# EAGLE design r10.2_328_1284 (EAGLE 9.0.1)
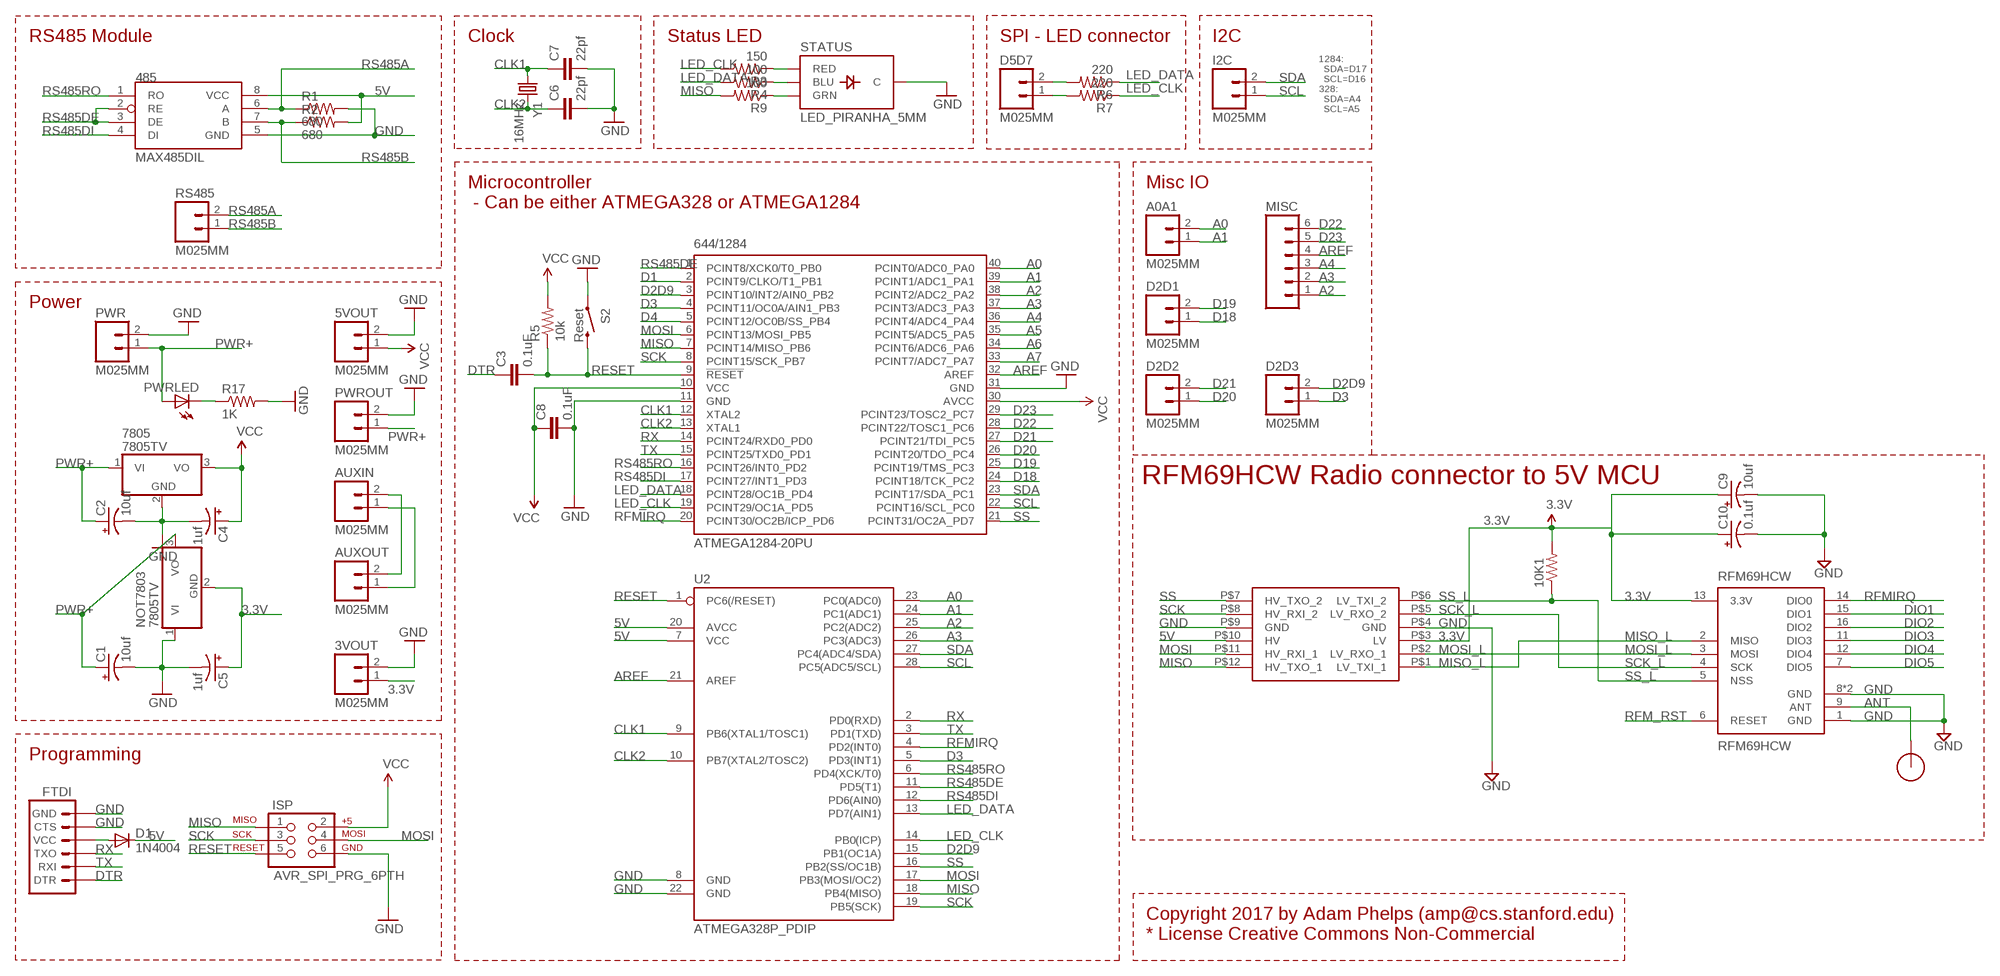
[diagram p0: schematic, sheet 1]

## Parts
3VOUT  M025MM  [SCREWTERMINAL-5MM-2]
5VOUT  M025MM  [SCREWTERMINAL-5MM-2]
10K1  RESISTORPTH-1/4W  [AXIAL-0.4]
485  MAX485DIL  [DIL08]
644/1284  ATMEGA1284-20PU  ATMEGA644-20PU  [DIL40]
7805  7805TV  [TO220V]
A0A1  M025MM  [SCREWTERMINAL-5MM-2]
AUXIN  M025MM  [SCREWTERMINAL-5MM-2]
AUXOUT  M025MM  [SCREWTERMINAL-5MM-2]
C1  10uf  CAP_POLPTH2  [CPOL-RADIAL-10UF-25V]
C2  10uf  CAP_POLPTH2  [CPOL-RADIAL-10UF-25V]
C3  0.1uF  CAPPTH  [CAP-PTH-SMALL]
C4  1uf  CAP_POLPTH2  [CPOL-RADIAL-10UF-25V]
C5  1uf  CAP_POLPTH2  [CPOL-RADIAL-10UF-25V]
C6  22pf  CAPPTH  [CAP-PTH-SMALL]
C7  22pf  CAPPTH  [CAP-PTH-SMALL]
C8  0.1uF  CAPPTH  [CAP-PTH-SMALL]
C9  10uf  CAP_POLPTH2  [CPOL-RADIAL-10UF-25V]
C10  0.1uf  CAP_POLPTH2  [CPOL-RADIAL-10UF-25V]
D1  1N4004  [DO41-10]
D2D1  M025MM  [SCREWTERMINAL-5MM-2]
D2D2  M025MM  [SCREWTERMINAL-5MM-2]
D2D3  M025MM  [SCREWTERMINAL-5MM-2]
D5D7  M025MM  [SCREWTERMINAL-5MM-2]
FTDI  ARDUINO_SERIAL_PROGRAMPTH  [1X06]
I2C  M025MM  [SCREWTERMINAL-5MM-2]
ISP  AVR_SPI_PRG_6PTH  [2X3]
LEVELCONVERTER1  LOGIC_LEVEL_CONVERTER  [LOGIC_LEVEL_CONVERTER]
MISC  M06NO_SILK  [1X06_NO_SILK]
NOT7803  7805TV  [TO220V]
PWR  M025MM  [SCREWTERMINAL-5MM-2]
PWRLED  LED5MM  [LED5MM]
PWROUT  M025MM  [SCREWTERMINAL-5MM-2]
R1  680  RESISTORPTH-1/4W  [AXIAL-0.4]
R2  680  RESISTORPTH-1/4W  [AXIAL-0.4]
R3  150  RESISTORPTH-1/4W  [AXIAL-0.4]
R4  100  RESISTORPTH-1/4W  [AXIAL-0.4]
R5  10k  RESISTORPTH-1/4W  [AXIAL-0.4]
R6  220  RESISTORPTH-1/4W  [AXIAL-0.4]
R7  220  RESISTORPTH-1/4W  [AXIAL-0.4]
R9  100  RESISTORPTH-1/4W  [AXIAL-0.4]
R17  1K  RESISTORPTH-1/4W  [AXIAL-0.4]
RFM69HCW  RFM69HCW  [RFM69HCW-XXXS2]
RS485  M025MM  [SCREWTERMINAL-5MM-2]
S2  Reset  SWITCH-MOMENTARY-2SMD  [TACTILE_SWITCH_SMD]
STATUS  LED_PIRANHA_5MM  [LED_PIRANHA_5MM]
U2  ATMEGA328P_PDIP  [DIL28-3]
U$2  RFM12B_ANTENNA  [RFM12B-ANTENNA]
Y1  16MHz  CRYSTALHC49US  [HC49US]

## Nets
3.3V: 3VOUT.1 10K1.P$2 C5.1(+) C9.1(+) C10.1(+) LEVELCONVERTER1.P$3(LV) NOT7803.2(GND) RFM69HCW.13(3.3V)
5V: 5VOUT.1 485.8(VCC) 644/1284.10(VCC) 644/1284.30(AVCC) 7805.3(VO) C4.1(+) C8.1 D1.C ISP.2 LEVELCONVERTER1.P$10(HV) R2.P$2 R5.P$2 U2.7(VCC) U2.20(AVCC) ; supply symbol labelled VCC
A0: 644/1284.40(PCINT0/ADC0_PA0) A0A1.2 U2.23(PC0(ADC0))
A1: 644/1284.39(PCINT1/ADC1_PA1) A0A1.1 U2.24(PC1(ADC1))
A2: 644/1284.38(PCINT2/ADC2_PA2) MISC.1 U2.25(PC2(ADC2))
A3: 644/1284.37(PCINT3/ADC3_PA3) MISC.2 U2.26(PC3(ADC3))
A4: 644/1284.36(PCINT4/ADC4_PA4) MISC.3
A5: 644/1284.35(PCINT5/ADC5_PA5)
A6: 644/1284.34(PCINT6/ADC6_PA6)
A7: 644/1284.33(PCINT7/ADC7_PA7)
ANT: RFM69HCW.9(ANT) U$2.P$1
AREF: 644/1284.32(AREF) MISC.4 U2.21(AREF)
CLK1: 644/1284.12(XTAL2) C7.1 U2.9(PB6(XTAL1/TOSC1)) Y1.1
CLK2: 644/1284.13(XTAL1) C6.1 U2.10(PB7(XTAL2/TOSC2)) Y1.2
D1: 644/1284.2(PCINT9/CLKO/T1_PB1)
D2D9: 644/1284.3(PCINT10/INT2/AIN0_PB2) D2D3.2 U2.15(PB1(OC1A))
D3: 644/1284.4(PCINT11/OC0A/AIN1_PB3) D2D3.1 U2.5(PD3(INT1))
D4: 644/1284.5(PCINT12/OC0B/SS_PB4)
D18: 644/1284.24(PCINT18/TCK_PC2) D2D1.1
D19: 644/1284.25(PCINT19/TMS_PC3) D2D1.2
D20: 644/1284.26(PCINT20/TDO_PC4) D2D2.1
D21: 644/1284.27(PCINT21/TDI_PC5) D2D2.2
D22: 644/1284.28(PCINT22/TOSC1_PC6) MISC.6
D23: 644/1284.29(PCINT23/TOSC2_PC7) MISC.5
DIO1: RFM69HCW.15(DIO1)
DIO2: RFM69HCW.16(DIO2)
DIO3: RFM69HCW.11(DIO3)
DIO4: RFM69HCW.12(DIO4)
DIO5: RFM69HCW.7(DIO5)
DTR: C3.1 FTDI.DTR
GND: 3VOUT.2 5VOUT.2 485.5(GND) 644/1284.11(GND) 644/1284.31(GND) 7805.2(GND) C1.2(-) C2.2(-) C4.2(-) C5.2(-) C6.2 C7.2 C8.2 C9.2(-) C10.2(-) FTDI.CTS FTDI.GND ISP.6 LEVELCONVERTER1.P$4(GND) LEVELCONVERTER1.P$9(GND) NOT7803.1(VI) PWR.2 PWROUT.2 R1.P$2 R17.P$2 RFM69HCW.1(GND) RFM69HCW.8(GND) RFM69HCW.10(GND) S2.1 STATUS.-(C) U2.8(GND) U2.22(GND)
LED_CLK: 644/1284.19(PCINT29/OC1A_PD5) R3.P$2 R7.P$1 U2.14(PB0(ICP))
LED_DATA: 644/1284.18(PCINT28/OC1B_PD4) R4.P$2 R6.P$1 U2.13(PD7(AIN1))
MISO: 644/1284.7(PCINT14/MISO_PB6) ISP.1 LEVELCONVERTER1.P$12(HV_TXO_1) R9.P$2 U2.18(PB4(MISO))
MISO_L: LEVELCONVERTER1.P$1(LV_TXI_1) RFM69HCW.2(MISO)
MOSI: 644/1284.6(PCINT13/MOSI_PB5) ISP.4 LEVELCONVERTER1.P$11(HV_RXI_1) U2.17(PB3(MOSI/OC2))
MOSI_L: LEVELCONVERTER1.P$2(LV_RXO_1) RFM69HCW.3(MOSI)
N$1: PWRLED.K(C) R17.P$1
N$2: AUXIN.1 AUXOUT.1
N$3: AUXIN.2 AUXOUT.2
N$4: D5D7.2 R6.P$2
N$5: R3.P$1 STATUS.R(RED)
N$6: R4.P$1 STATUS.B(BLU)
N$7: R9.P$1 STATUS.G(GRN)
N$8: D5D7.1 R7.P$2
N$9: D1.A FTDI.VCC
PWR+: 7805.1(VI) C1.1(+) C2.1(+) NOT7803.3(VO) PWR.1 PWRLED.A PWROUT.1
RESET: 644/1284.9(!RESET) C3.2 ISP.5 R5.P$1 S2.3 U2.1(PC6(/RESET))
RFM_RST: RFM69HCW.6(RESET)
RFMIRQ: 644/1284.20(PCINT30/OC2B/ICP_PD6) RFM69HCW.14(DIO0) U2.4(PD2(INT0))
RS485A: 485.6(A) R1.P$1 RS485.2
RS485B: 485.7(B) R2.P$1 RS485.1
RS485DE: 485.2(RE) 485.3(DE) 644/1284.1(PCINT8/XCK0/T0_PB0) U2.11(PD5(T1))
RS485DI: 485.4(DI) 644/1284.17(PCINT27/INT1_PD3) U2.12(PD6(AIN0))
RS485RO: 485.1(RO) 644/1284.16(PCINT26/INT0_PD2) U2.6(PD4(XCK/T0))
RX: 644/1284.14(PCINT24/RXD0_PD0) FTDI.TXO U2.2(PD0(RXD))
SCK: 644/1284.8(PCINT15/SCK_PB7) ISP.3 LEVELCONVERTER1.P$8(HV_RXI_2) U2.19(PB5(SCK))
SCK_L: LEVELCONVERTER1.P$5(LV_RXO_2) RFM69HCW.4(SCK)
SCL: 644/1284.22(PCINT16/SCL_PC0) I2C.1 U2.28(PC5(ADC5/SCL))
SDA: 644/1284.23(PCINT17/SDA_PC1) I2C.2 U2.27(PC4(ADC4/SDA))
SS: 644/1284.21(PCINT31/OC2A_PD7) LEVELCONVERTER1.P$7(HV_TXO_2) U2.16(PB2(SS/OC1B))
SS_L: 10K1.P$1 LEVELCONVERTER1.P$6(LV_TXI_2) RFM69HCW.5(NSS)
TX: 644/1284.15(PCINT25/TXD0_PD1) FTDI.RXI U2.3(PD1(TXD))

## Notes on the sheet
- RS485 Module | Clock | Status LED | SPI - LED connector | I2C
- 1284:
    SDA=D17
    SCL=D16
  328:
    SDA=A4
    SCL=A5
- Microcontroller
   - Can be either ATMEGA328 or ATMEGA1284
- Misc IO
- Power
- RFM69HCW Radio connector to 5V MCU
- Programming
- Copyright 2017 by Adam Phelps (amp@cs.stanford.edu)
  * License Creative Commons Non-Commercial

## Library data of the parts
3VOUT 5VOUT A0A1 AUXIN AUXOUT D2D1-D2D3 D5D7 I2C PWR PWROUT RS485 = SparkFun-Connectors:M02: Standard 2-pin 0.1" header. Use with - straight break away headers ( PRT-00116) - right angle break away headers (PRT-00553) - swiss pins (PRT-00743) - machine pins (PRT-00117) - female headers (PRT-00115) Molex polarized connector foot print use with: PRT-08233 with associated crimp pins and housings. 2.54_SCREWTERM for use with PRT-10571. 3.5mm Screw Terminal footprints for PRT-08084 5mm Screw Terminal footprints for use with PRT-08433
10K1 R3-R7 R9 = SparkFun-Passives:RESISTOR: Resistor Basic schematic elements and footprints for 0603, 1206, and PTH resistors.
485 = SparkFun-DigitalIC:MAX485: RS-485 transceiver
644/1284 = atmel:ATMEGA644-*PU: 8-bit Microcontroller with 64K Bytes In-System Programmable Flash Auto generated by make-symbol-device-package-bsdl.ulp Rev. 34 Source: http://www.atmel.com/dyn/resources/prod_documents/doc2593.pdf; MPN: ATMEGA644-20PU; OC_FARNELL: 1288340; OC_NEWARK: 23M5060
7805 NOT7803 = linear:78*: Positive VOLTAGE REGULATOR Source: http://cache.national.com/ds/LM/LM78L05.pdf http://www.fairchildsemi.com/ds/LM/LM7805.pdf
C1 C2 C4 C5 C9 C10 = SparkFun-Capacitors:CAP_POL: Capacitor Polarized These are standard SMD and PTH capacitors. Normally 10uF, 47uF, and 100uF in electrolytic and tantalum varieties. Always verify the external diameter of the through hole cap, it varies with capacity, voltage, and manufacturer. The EIA devices should be standard.
C3 C6-C8 = SparkFun-Capacitors:CAP: Capacitor Standard 0603 ceramic capacitor, and 0.1" leaded capacitor.
D1 = adafruit:1N4004: DIODE General purpose 1N400x type rectifier (With bigger pads) http://www.ladyada.net/library/pcb/eaglelibrary.html
FTDI = SparkFun-Connectors:ARDUINO_SERIAL_PROGRAM: FTDI connector footprints
ISP = SparkFun-Connectors:AVR_SPI_PRG_6: AVR ISP 6 Pin This is the reduced ISP connector for AVR programming. Common on Arduino. This footprint will take up less PCB space and can be used with a 10-pin to 6-pin adapter such as SKU: BOB-08508
LEVELCONVERTER1 = SparkFun-Boards:LOGIC_LEVEL_CONVERTER: Logic Level Converter (3.3v - 5v) https://www.sparkfun.com/products/8745
MISC = SparkFun-Connectors:M06: Header 6 Standard 6-pin 0.1" header. Use with straight break away headers (SKU : PRT-00116), right angle break away headers (PRT-00553), swiss pins (PRT-00743), machine pins (PRT-00117), and female headers (PRT-00115). Molex polarized connector foot print use with SKU : PRT-08094 with associated crimp pins and housings. NOTES ON THE VARIANTS LOCK and LOCK_LONGPADS... This footprint was designed to help hold the alignment of a through-hole component (i.e. 6-pin header) while soldering it into place. You may notice that each hole has been shifted either up or down by 0.005 of an inch from it's more standard position (which is a perfectly straight line). This slight alteration caused the pins (the squares in the middle) to touch the edges of the holes. Because they are alternating, it causes a "brace" to hold the component in place. 0.005 has proven to be the perfect amount of "off-center" position when using our standard breakaway headers. Although looks a little odd when you look at the bare footprint, once you have a header in there, the alteration is very hard to notice. Also,if you push a header all the way into place, it is covered up entirely on the bottom side. This idea of altering the position of holes to aid alignment will be further integrated into the Sparkfun Library for other footprints. It can help hold any component with 3 or more connection pins.
PWRLED = SparkFun-LED:LED: LEDs Standard schematic elements and footprints for 5mm, 3mm, 1206, and 0603 sized LEDs. 5mm - Spark Fun Electronics SKU : COM-00529 (and others)
R1 R2 R17 = SparkFun-Resistors:RESISTOR: Resistor Basic schematic elements and footprints for 0603, 1206, and PTH resistors.
RFM69HCW = mike-temp:RFM69H
S2 = SparkFun:SWITCH-MOMENTARY-2
STATUS = SparkFun-LED:LED_PIRANHA_5MM: High-brightness RGB through-hole LED, similar to that used in the Shiftbrite
U2 = SparkFun-DigitalIC:ATMEGA328P_PDIP: uC used in the Arduino 32kb flash, 1k EEPROM, 2k SRAM This is the through-hole version of this chip.
U$2 = LowPowerLab:RFM12B_ANTENNA
Y1 = SparkFun-FreqCtrl:CRYSTAL: Various standard crystals. Proven footprints. Spark Fun Electronics SKU : COM-00534

## Board
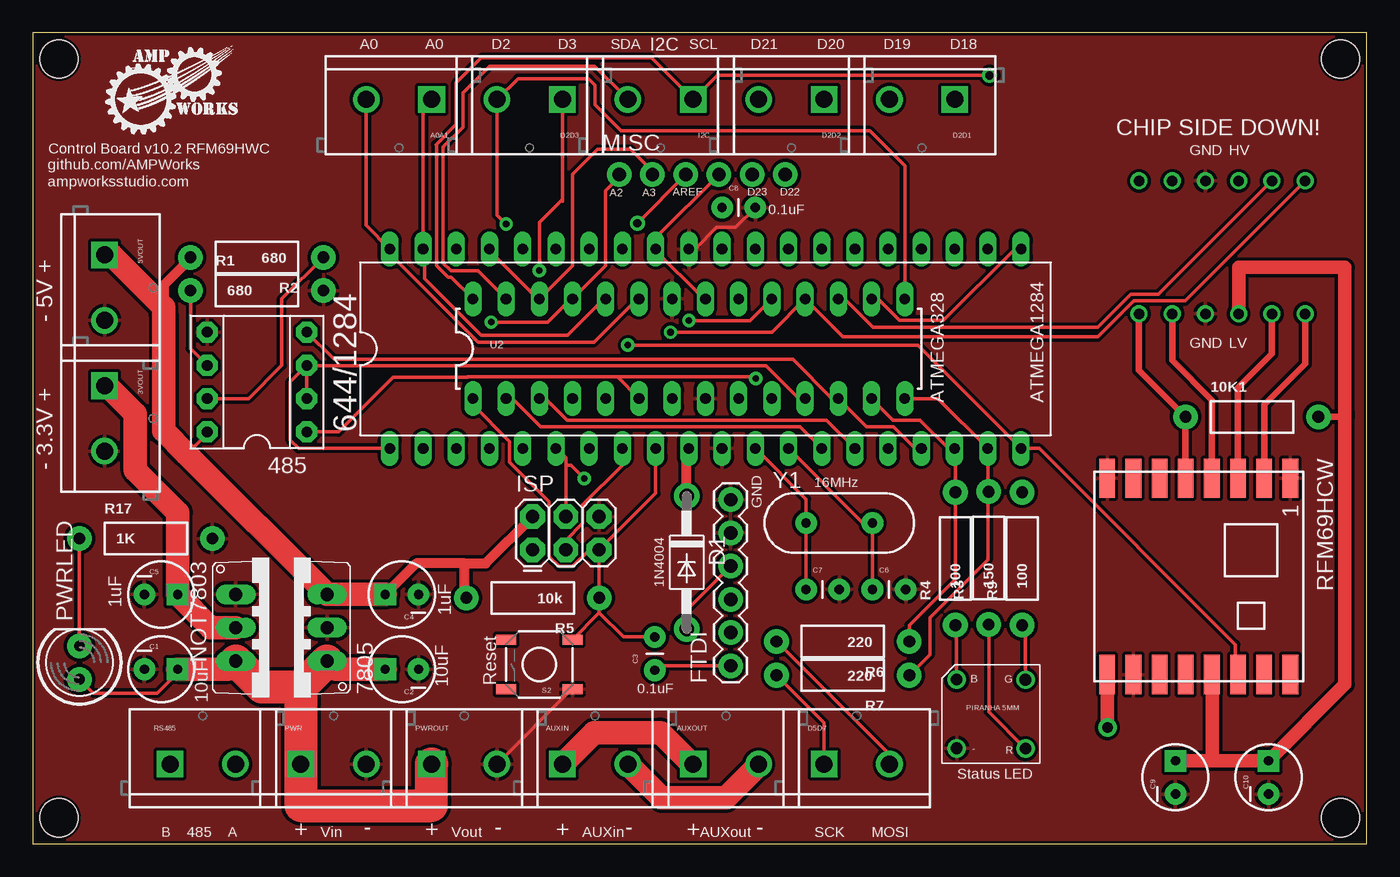
[diagram p1: board, top side]
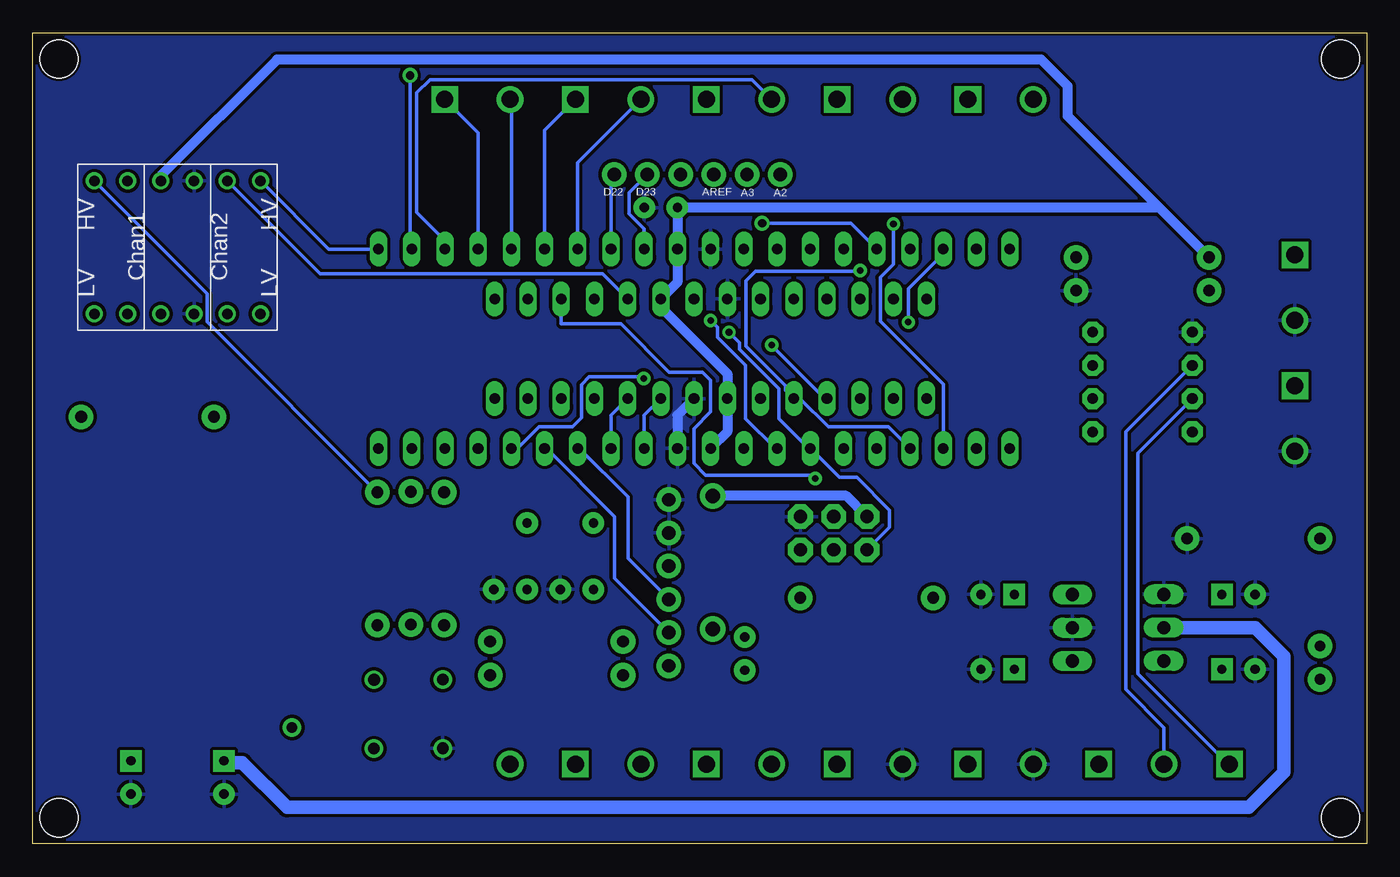
[diagram p2: board, bottom side, seen from below]

Size 102 x 62 mm. Coordinates in mm from the lower left corner, seen from the top.
Outline: 0,0 102,0 102,62 0,62 0,0
Copper layers (1*16): Top 0.035mm / dielectric 1.5mm / Bottom 0.035mm
Design rules "SparkFun-2-layer-STANDARD": minimum track width 10mil, minimum drill 20mil, track to track 10mil, track to pad 8mil, pad to pad 8mil, via to via 10mil, smd to smd 8mil, copper to edge 8mil, drill to drill 8mil, minimum pad ring 10mil, minimum via ring 10mil, stop-mask expansion 4mil, vias tented up to drill 25mil, thermal gap 10mil
Holes 2.92 mm at 2,60 100,60 100,2 2,2

### Footprints (pad centres in the part's own frame; a part is rotated, then mirrored left to right if it is on the bottom)
SCREWTERMINAL-5MM-2 = drill 1.3 pad 2.032 square: 1 0,0 | drill 1.3 pad 2.032: 2 5,0
AXIAL-0.4 = drill 0.9 pad 1.88: P$1 -5.08,0; P$2 5.08,0
DIL08 = drill 0.813 pad 1.6 octagon: 1 -3.81,-3.81; 2 -1.27,-3.81; 3 1.27,-3.81; 4 3.81,-3.81; 5 3.81,3.81; 6 1.27,3.81; 7 -1.27,3.81; 8 -3.81,3.81
DIL40 = drill 0.813 long: 1 -24.13,-7.62; 2 -21.59,-7.62; 3 -19.05,-7.62; 4 -16.51,-7.62; 5 -13.97,-7.62; 6 -11.43,-7.62; 7 -8.89,-7.62; 8 -6.35,-7.62; 9 -3.81,-7.62; 10 -1.27,-7.62; 11 1.27,-7.62; 12 3.81,-7.62; 13 6.35,-7.62; 14 8.89,-7.62; 15 11.43,-7.62; 16 13.97,-7.62; 17 16.51,-7.62; 18 19.05,-7.62; 19 21.59,-7.62; 20 24.13,-7.62; 21 24.13,7.62; 22 21.59,7.62; 23 19.05,7.62; 24 16.51,7.62; 25 13.97,7.62; 26 11.43,7.62; 27 8.89,7.62; 28 6.35,7.62; 29 3.81,7.62; 30 1.27,7.62; 31 -1.27,7.62; 32 -3.81,7.62; 33 -6.35,7.62; 34 -8.89,7.62; 35 -11.43,7.62; 36 -13.97,7.62; 37 -16.51,7.62; 38 -19.05,7.62; 39 -21.59,7.62; 40 -24.13,7.62
TO220V = drill 1.016 long: 1 -2.54,-2.54; 2 0,-2.54; 3 2.54,-2.54
CPOL-RADIAL-10UF-25V = drill 0.7 pad 1.651 square: 1 1.27,0 | drill 0.7 pad 1.651: 2 -1.27,0
CAP-PTH-SMALL = drill 0.7 pad 1.651: 1 0,0; 2 2.54,0
DO41-10 = drill 1.118 pad 1.93: A 5.08,0; C -5.08,0
1X06 = drill 1.016 pad 1.88: CTS 10.16,0; DTR 0,0; GND 12.7,0; RXI 2.54,0; TXO 5.08,0; VCC 7.62,0
2X3 = drill 1.016 pad 1.88 octagon: 1 0,0; 2 0,2.54; 3 2.54,0; 4 2.54,2.54; 5 5.08,0; 6 5.08,2.54
LOGIC_LEVEL_CONVERTER = drill 0.8: P$1 1.27,13.97; P$2 1.27,11.43; P$3 1.27,8.89; P$4 1.27,6.35; P$5 1.27,3.81; P$6 1.27,1.27; P$7 11.43,1.27; P$8 11.43,3.81; P$9 11.43,6.35; P$10 11.43,8.89; P$11 11.43,11.43; P$12 11.43,13.97
1X06_NO_SILK = drill 1.016 pad 1.88: 1 0,0; 2 2.54,0; 3 5.08,0; 4 7.62,0; 5 10.16,0; 6 12.7,0
LED5MM = drill 0.813 pad 1.88: A -1.27,0; K 1.27,0
RFM69HCW-XXXS2 = smd 3 x 1.2: 1 -7.5,7; 2 -7.5,5; 3 -7.5,3; 4 -7.5,1; 5 -7.5,-1; 6 -7.5,-3; 7 -7.5,-5; 8 -7.5,-7; 9 7.5,-7; 10 7.5,-5; 11 7.5,-3; 12 7.5,-1; 13 7.5,1; 14 7.5,3; 15 7.5,5; 16 7.5,7
TACTILE_SWITCH_SMD = smd 1.524 x 0.762: 1 -2.54,1.905; 2 2.54,1.905; 3 -2.54,-1.905; 4 2.54,-1.905
LED_PIRANHA_5MM = drill 0.9: - -2.684,-2.684; B -2.688,2.574; G 2.575,2.562; R 2.579,-2.696
DIL28-3 = drill 0.813 long: 1 -16.51,-3.81; 2 -13.97,-3.81; 3 -11.43,-3.81; 4 -8.89,-3.81; 5 -6.35,-3.81; 6 -3.81,-3.81; 7 -1.27,-3.81; 8 1.27,-3.81; 9 3.81,-3.81; 10 6.35,-3.81; 11 8.89,-3.81; 12 11.43,-3.81; 13 13.97,-3.81; 14 16.51,-3.81; 15 16.51,3.81; 16 13.97,3.81; 17 11.43,3.81; 18 8.89,3.81; 19 6.35,3.81; 20 3.81,3.81; 21 1.27,3.81; 22 -1.27,3.81; 23 -3.81,3.81; 24 -6.35,3.81; 25 -8.89,3.81; 26 -11.43,3.81; 27 -13.97,3.81; 28 -16.51,3.81
RFM12B-ANTENNA = drill 0.8 pad 1.422: P$1 0,0
HC49US = drill 0.7 pad 1.651: 1 -2.54,0; 2 2.54,0

### Placement (x,y rotation side)
3VOUT  5.5,35.02 270 top
5VOUT  5.5,45.02 270 top
10K1  93.22,32.64 0 top
485  17.14,35.31 90 top
644/1284  51.44,37.85 0 top
7805  19.97,16.53 90 top
A0A1  30.5,56.9 180 top
AUXIN  40.5,6.1 0 top
AUXOUT  50.5,6.1 0 top
C1  9.81,13.35 0 top
C2  28.23,13.35 180 top
C3  47.55,13.28 90 top
C4  28.23,19.07 180 top
C5  9.81,19.07 0 top
C6  64.2,19.45 0 top
C7  59.12,19.45 0 top
C8  52.7,48.64 0 top
C9  87.38,5.08 90 top
C10  94.49,5.08 90 top
D1  50,21.52 270 top
D2D1  70.5,56.9 180 top
D2D2  60.5,56.9 180 top
D2D3  40.5,56.9 180 top
D5D7  60.5,6.1 0 top
FTDI  53.36,13.61 90 top
I2C  50.5,56.9 180 top
ISP  38.22,22.48 0 top
LEVELCONVERTER1  83.31,39.24 90 bottom
MISC  44.84,51.16 0 top
NOT7803  18.07,16.53 270 top
PWR  20.5,6.1 0 top
PWRLED  3.58,13.85 90 top
PWROUT  30.5,6.1 0 top
R1  17.14,42.29 0 top
R2  17.14,44.83 180 top
R3  73.09,21.84 90 top
R4  70.55,21.8 90 top
R5  38.23,18.81 180 top
R6  61.94,15.47 180 top
R7  61.94,12.89 180 top
R9  75.65,21.8 90 top
R17  8.65,23.34 0 top
RFM69HCW  89.15,20.45 270 top
RS485  10.5,6.1 0 top
S2  38.73,13.72 180 top
STATUS  73.33,9.99 0 top
U2  50.16,37.85 0 top
U$2  82.17,8.89 90 top
Y1  61.66,24.53 0 top

### Tracks (layer width: path | path; a pad name or v marks a point on that pad's centre or on a via)
3.3V
  Top 0.254: 100.33,32.64 100.33,32.92
  Top 0.508: 100.33,32.64 10K1.P$2
  Top 1.016: RFM69HCW.13 90.17,12.95 90.17,6.6 89.92,6.35 | LEVELCONVERTER1.P$3 92.2,44.07 100.33,44.07 100.33,32.92 | 89.92,6.35 C9.1 | 89.92,6.35 C10.1 100.33,12.19 100.33,32.64
  Top 1.778: 3VOUT.1 5.7,35.02 7.85,32.87 7.85,28.57 11.1,25.32 11.1,19.09 C5.1 13.62,16.53 NOT7803.2
  Bottom 1.016: NOT7803.2 8.53,16.53 6.35,14.35 6.35,5.46 9.02,2.79 82.55,2.79 85.98,6.22 87.38,6.22 C9.1
5V
  Top 0.254: 485.8 13.34,31.35 11.78,29.8 | R2.P$2 12.06,44.78
  Top 0.762: 12.06,44.78 10,42.72 10,40.52 | D1.C 50,30.06 644/1284.10 | ISP.2 34.64,21.44 33.02,21.44 | C4.1 29.32,21.44 33.02,21.44 | R5.P$2 33.02,18.94 33.02,21.44
  Top 1.778: C4.1 7805.3 11.78,29.8 10,31.58 10,40.52 10,41.02 6,45.02 5VOUT.1
  Bottom 0.762: R2.P$2 15.88,48.64 | 15.88,48.64 C8.1 644/1284.30 52.7,42.93 U2.20 53.98,41.02 48.9,35.94 U2.7 48.9,31.5 644/1284.10 | ISP.2 39.8,26.6 D1.C | 15.88,48.64 22.86,55.63 22.86,57.91 24.89,59.94 83.31,59.94 92.2,51.05 LEVELCONVERTER1.P$10
A0
  Top 0.254: A0A1.2 25.5,47.27 644/1284.40 27.43,45.47 27.43,44.96 34.04,38.35 42.93,38.35 46.23,41.66 U2.23
A1
  Top 0.254: A0A1.1 29.84,56.24 644/1284.39 29.97,45.47 29.97,43.18 34.29,38.86 40.89,38.86 43.69,41.66 U2.24
A2  (via drill 0.51)
  Top 0.254: v35.05,39.88 39.37,39.88 41.15,41.66 U2.25 43.81,44.2 43.81,49.91 44.84,50.94 MISC.1
  Bottom 0.254: v35.05,39.88 35.05,42.42 32.51,44.96 32.51,45.47 644/1284.38
A3
  Top 0.254: 644/1284.37 34.8,45.47 38.61,41.66 U2.26 41.27,44.2 41.27,51.18 43.18,53.09 45.72,53.09 47.38,51.42 MISC.2
A4  (via drill 0.64)
  Top 0.254: v46.23,47.43 49.92,51.13 MISC.3
  Bottom 0.254: 644/1284.36 39.43,47.43 v46.23,47.43
ANT
  Top 1.016: RFM69HCW.9 82.15,8.9 U$2.P$1
AREF
  Top 0.254: U2.21 51.31,41.66 47.5,45.47 644/1284.32 47.62,46.32 MISC.4
CLK1
  Top 0.254: C7.1 Y1.1 59.12,26.35 644/1284.12
  Bottom 0.254: U2.9 55.24,32.77 644/1284.12
CLK2
  Top 0.254: C6.1 Y1.2 63.48,24.53 644/1284.13
  Bottom 0.254: U2.10 57.78,32.77 644/1284.13
D2D9  (via drill 0.51)
  Top 0.254: v36.2,47.37 35.5,48.07 D2D3.2 37.1,58.5 42.5,58.5 43,58 43,56.5 45,54.5 64,54.5 66.67,51.83 U2.15
  Bottom 0.254: v36.2,47.37 36.2,44.29 37.19,43.3 37.19,39.94 32.38,35.14 644/1284.3
D3  (via drill 0.51)
  Top 0.254: 40.5,49.14 40.5,49.28 | 40.5,49.28 D2D3.1 | 40.5,49.28 38.73,47.51 v38.73,43.81
  Bottom 0.254: 644/1284.4 36.58,31.88 41.18,31.88 43.34,34.04 U2.5 44.45,34.67 44.45,35.01 47.47,38.03 47.47,43.03 46.75,43.75 38.77,43.75 38.73,43.72 v38.73,43.81
D18
  Bottom 0.254: 644/1284.24 67.94,54.34 D2D1.1
D19
  Bottom 0.254: 644/1284.25 65.41,56.8 D2D1.2
D20
  Bottom 0.254: 644/1284.26 62.87,54.53 D2D2.1
D21
  Bottom 0.254: 644/1284.27 60.33,52.07 D2D2.2
D22
  Bottom 0.254: 644/1284.28 57.78,50.92 MISC.6
D23
  Bottom 0.254: 644/1284.29 55.24,47.01 56.4,48.16 56.4,49.76 MISC.5
DTR
  Top 0.254: C3.1 47.89,13.61 FTDI.DTR
GND
  Top 0.254: PWROUT.2 41.22,11.81 S2.1 | 644/1284.31 50.64,45.47 52.3,47.12 53.72,47.12 C8.2
  Top 0.406: 82.55,27.95 RFM69HCW.8
  Bottom 0.762: U2.8 52.7,32.77 644/1284.11
  pour Bottom: 0,62.03 102.22,62.03 102.23,0 0,0
  pour Top: 0,0 0,61.85 102.36,61.85 102.23,0
LED_CLK
  Top 0.254: 73.03,26.99 644/1284.19 69.22,34.04 U2.14 | 73.03,26.99 R3.P$2 | 73.03,26.99 73.03,21.72 68.58,17.27 68.58,14.45 R7.P$1
LED_DATA
  Top 0.254: U2.13 65.79,32.38 67.85,32.38 70.01,30.23 644/1284.18 70.55,30.16 R4.P$2 70.55,20.38 70.61,20.32 67.02,16.73 R6.P$1
MISO  (via drill 0.51)
  Top 0.254: v48.77,39.11 49.8,39.11 56.51,39.11 U2.18 61.96,38.75 81.43,38.75 84.17,41.5 88.11,41.5 LEVELCONVERTER1.P$12
  Bottom 0.254: ISP.1 36.5,24.2 36.5,25.52 39,28.02 40.34,28.02 644/1284.7 42.67,30.23 44.96,32.51 44.96,34.8 47.98,37.82 47.98,38.32 v48.77,39.11 | LEVELCONVERTER1.P$12 88.67,42.06 88.67,39.9 R9.P$2
MISO_L
  Top 0.508: LEVELCONVERTER1.P$1 97.28,36.7 94.15,33.58 RFM69HCW.2
MOSI  (via drill 0.51)
  Top 0.254: 644/1284.6 40.05,30.23 40.76,29.52 40.76,28.96 | 40.76,28.96 ISP.4 | v42.16,27.94 41.15,28.96 40.76,28.96 | U2.17 62.07,41.66 64.23,39.5 81.46,39.5 83.96,42.01 86.07,42.01 LEVELCONVERTER1.P$11
  Bottom 0.254: U2.17 61.59,39.75 57.02,39.75 53.34,36.07 50.8,36.07 50.16,35.43 50.16,33.02 51.44,31.75 51.44,29.08 50.55,28.19 42.42,28.19 v42.16,27.94
MOSI_L
  Top 0.508: RFM69HCW.3 92.15,34.88 94.74,37.47 LEVELCONVERTER1.P$2
N$1
  Top 0.254: PWRLED.K R17.P$1
N$2
  Top 1.778: AUXIN.1 42.92,8.52 48,8.52 50.42,6.1 AUXOUT.1
N$3
  Top 1.778: AUXIN.2 48.08,3.52 53,3.52 55.5,6.02 AUXOUT.2
N$4
  Top 0.254: R6.P$2 65.5,6.84 D5D7.2
N$5
  Top 0.254: R3.P$1 73.09,10.11 STATUS.R
N$6
  Top 0.254: R4.P$1 70.64,16.63 STATUS.B
N$7
  Top 0.254: STATUS.G 75.91,16.47 R9.P$1
N$8
  Top 0.254: R7.P$2 60.5,9.26 D5D7.1
N$9
  Top 0.254: D1.A 50,17.87 FTDI.VCC
PWR+
  Top 0.254: C1.1 11.08,13.1 9.5,11.52 4.64,11.52 PWRLED.A
  Top 1.778: C2.1 23.14,13.35 7805.1 | C1.1 14.89,13.35 NOT7803.3
  Top 2.54: 20.5,11.98 PWR.1 20.5,2.92 30.48,2.92 30.48,6.1 PWROUT.1 | 20.5,11.98 7805.1 | 20.5,11.98 17.54,11.98 NOT7803.3
RESET
  Top 0.254: ISP.5 47.62,26.8 644/1284.9 | 43.31,17.66 S2.3 | 43.31,17.66 R5.P$1 43.3,18.82 ISP.5 | 43.31,17.66 45.16,15.82 C3.2 | U2.1 33.66,33.56 36.47,30.74 36.47,29.16 39.49,26.14 39.49,21.95 40.23,21.21 41.29,21.21 42.56,22.48 ISP.5
RFMIRQ  (via drill 0.51)
  Top 0.254: RFM69HCW.14 91.95,13.15 91.95,15.24 76.96,30.23 644/1284.20 67.67,38.12 v45.5,38.12
  Bottom 0.254: v45.5,38.12 41.41,34.04 U2.4
RS485A
  Top 0.254: R1.P$1 12.06,37.85 485.6
  Bottom 0.254: 485.6 18.41,31.5 18.41,11.81 15.5,8.9 RS485.2
RS485B
  Top 0.254: 485.7 16.51,34.04 19.05,36.58 19.05,41.66 R2.P$1
  Bottom 0.254: RS485.1 10.58,6.1 17.5,13.02 17.5,29.87 485.7
RS485DE
  Top 0.254: 485.3 485.2 | 644/1284.1 20.32,30.23 19.68,30.86 19.68,35.31 485.3 | U2.11 58.58,34.04 56.08,36.53 21,36.53 485.3
RS485DI
  Top 0.254: 644/1284.17 67.47,30.23 65.81,31.88 63.75,31.88 U2.12 61.12,34.04 58.11,37.04 23.03,37.04 485.4
RS485RO  (via drill 0.51 pad 0.51)
  Top 0.254: 44.7,35.69 U2.6 | 44.7,35.69 33.24,35.69 33.24,35.68 27.57,35.68 23.39,31.5 485.1 | 44.7,35.69 44.74,35.72 55.14,35.72 v55.28,35.57
  Bottom 0.254: 644/1284.16 64.93,30.23 63.27,31.88 60.73,31.88 60.05,32.57 60.05,35.11 59.47,35.69 55.4,35.69 v55.28,35.57
RX
  Top 0.254: 644/1284.14 58.67,31.88 38.83,31.88 36.67,34.04 U2.2
  Bottom 0.254: 644/1284.14 60.21,30.23 56.5,26.52 56.5,21.83 FTDI.TXO
SCK  (via drill 0.51)
  Top 0.254: ISP.3 40.76,23.22 42.03,24.49 42.03,25.54 42.04,25.55 42.04,25.91 45.09,28.96 644/1284.8 | U2.19 54.85,39.99 v50.17,39.99
  Bottom 0.254: 644/1284.8 45.21,30.23 47.5,32.51 47.5,36.58 49.66,38.74 49.66,39.48 v50.17,39.99 | LEVELCONVERTER1.P$8 80.01,43.56 58.42,43.56 U2.19
SCK_L
  Top 0.508: RFM69HCW.4 90.15,33.92 87.12,36.96 LEVELCONVERTER1.P$5
SCL  (via drill 0.64)
  Top 0.254: U2.28 32,43.31 31.76,43.31 30.89,44.19 30.89,53.39 30.84,53.44 32.38,54.99 32.38,58.17 34.29,60.07 47.33,60.07 I2C.1 52.34,58.74 v73.15,58.74
  Bottom 0.254: 644/1284.22 73.15,45.47 v73.15,58.74
SDA
  Top 0.254: U2.27 34.04,43.81 31.98,43.81 31.39,44.4 31.39,53.28 32.89,54.78 32.89,57.4 34.92,59.44 42.96,59.44 I2C.2
  Bottom 0.254: 644/1284.23 70.48,46.1 72.64,48.26 72.64,57.4 71.63,58.42 47.02,58.42 I2C.2
SS
  Top 0.254: 644/1284.21 75.09,45.47 69.62,40.01 66.27,40.01 64.61,41.66 U2.16
  Bottom 0.254: LEVELCONVERTER1.P$7 79.38,45.47 644/1284.21
SS_L
  Top 0.254: 88.14,27.96 RFM69HCW.5
  Top 0.508: 88.14,27.96 10K1.P$1 84.58,36.2 LEVELCONVERTER1.P$6
TX
  Top 0.254: U2.3 39.21,34.04 40.87,32.38 60.71,32.38 644/1284.15
  Bottom 0.254: 644/1284.15 62.71,30.23 57.5,25.02 57.5,20.29 FTDI.RXI

### Text on the board
tPlace: A0 | A0 | D2 | D3 | SDA | I2C | SCL | D21 | D20 | D19 | D18 | CHIP SIDE DOWN! | Control Board v10.2 RFM69HWC | GND | HV | github.com/AMPWorks | ampworksstudio.com | AREF | D23 | D22 | A2 | A3 | 0.1uF | - 5V + | GND | LV | ATMEGA328 | ATMEGA1284 | - 3.3V + | 16MHz | GND | 1uF | 1N4004 | 1uF | 10uF | Reset | 10uF | 0.1uF | Status LED | B | 485 | A | + | Vin | - | + | Vout | - | + | AUXin | - | + | AUXout | - | SCK | MOSI
bPlace: AREF | D23 | D22 | A2 | A3